# EAGLE design TT7-F v1.5 (EAGLE 7.4.0)
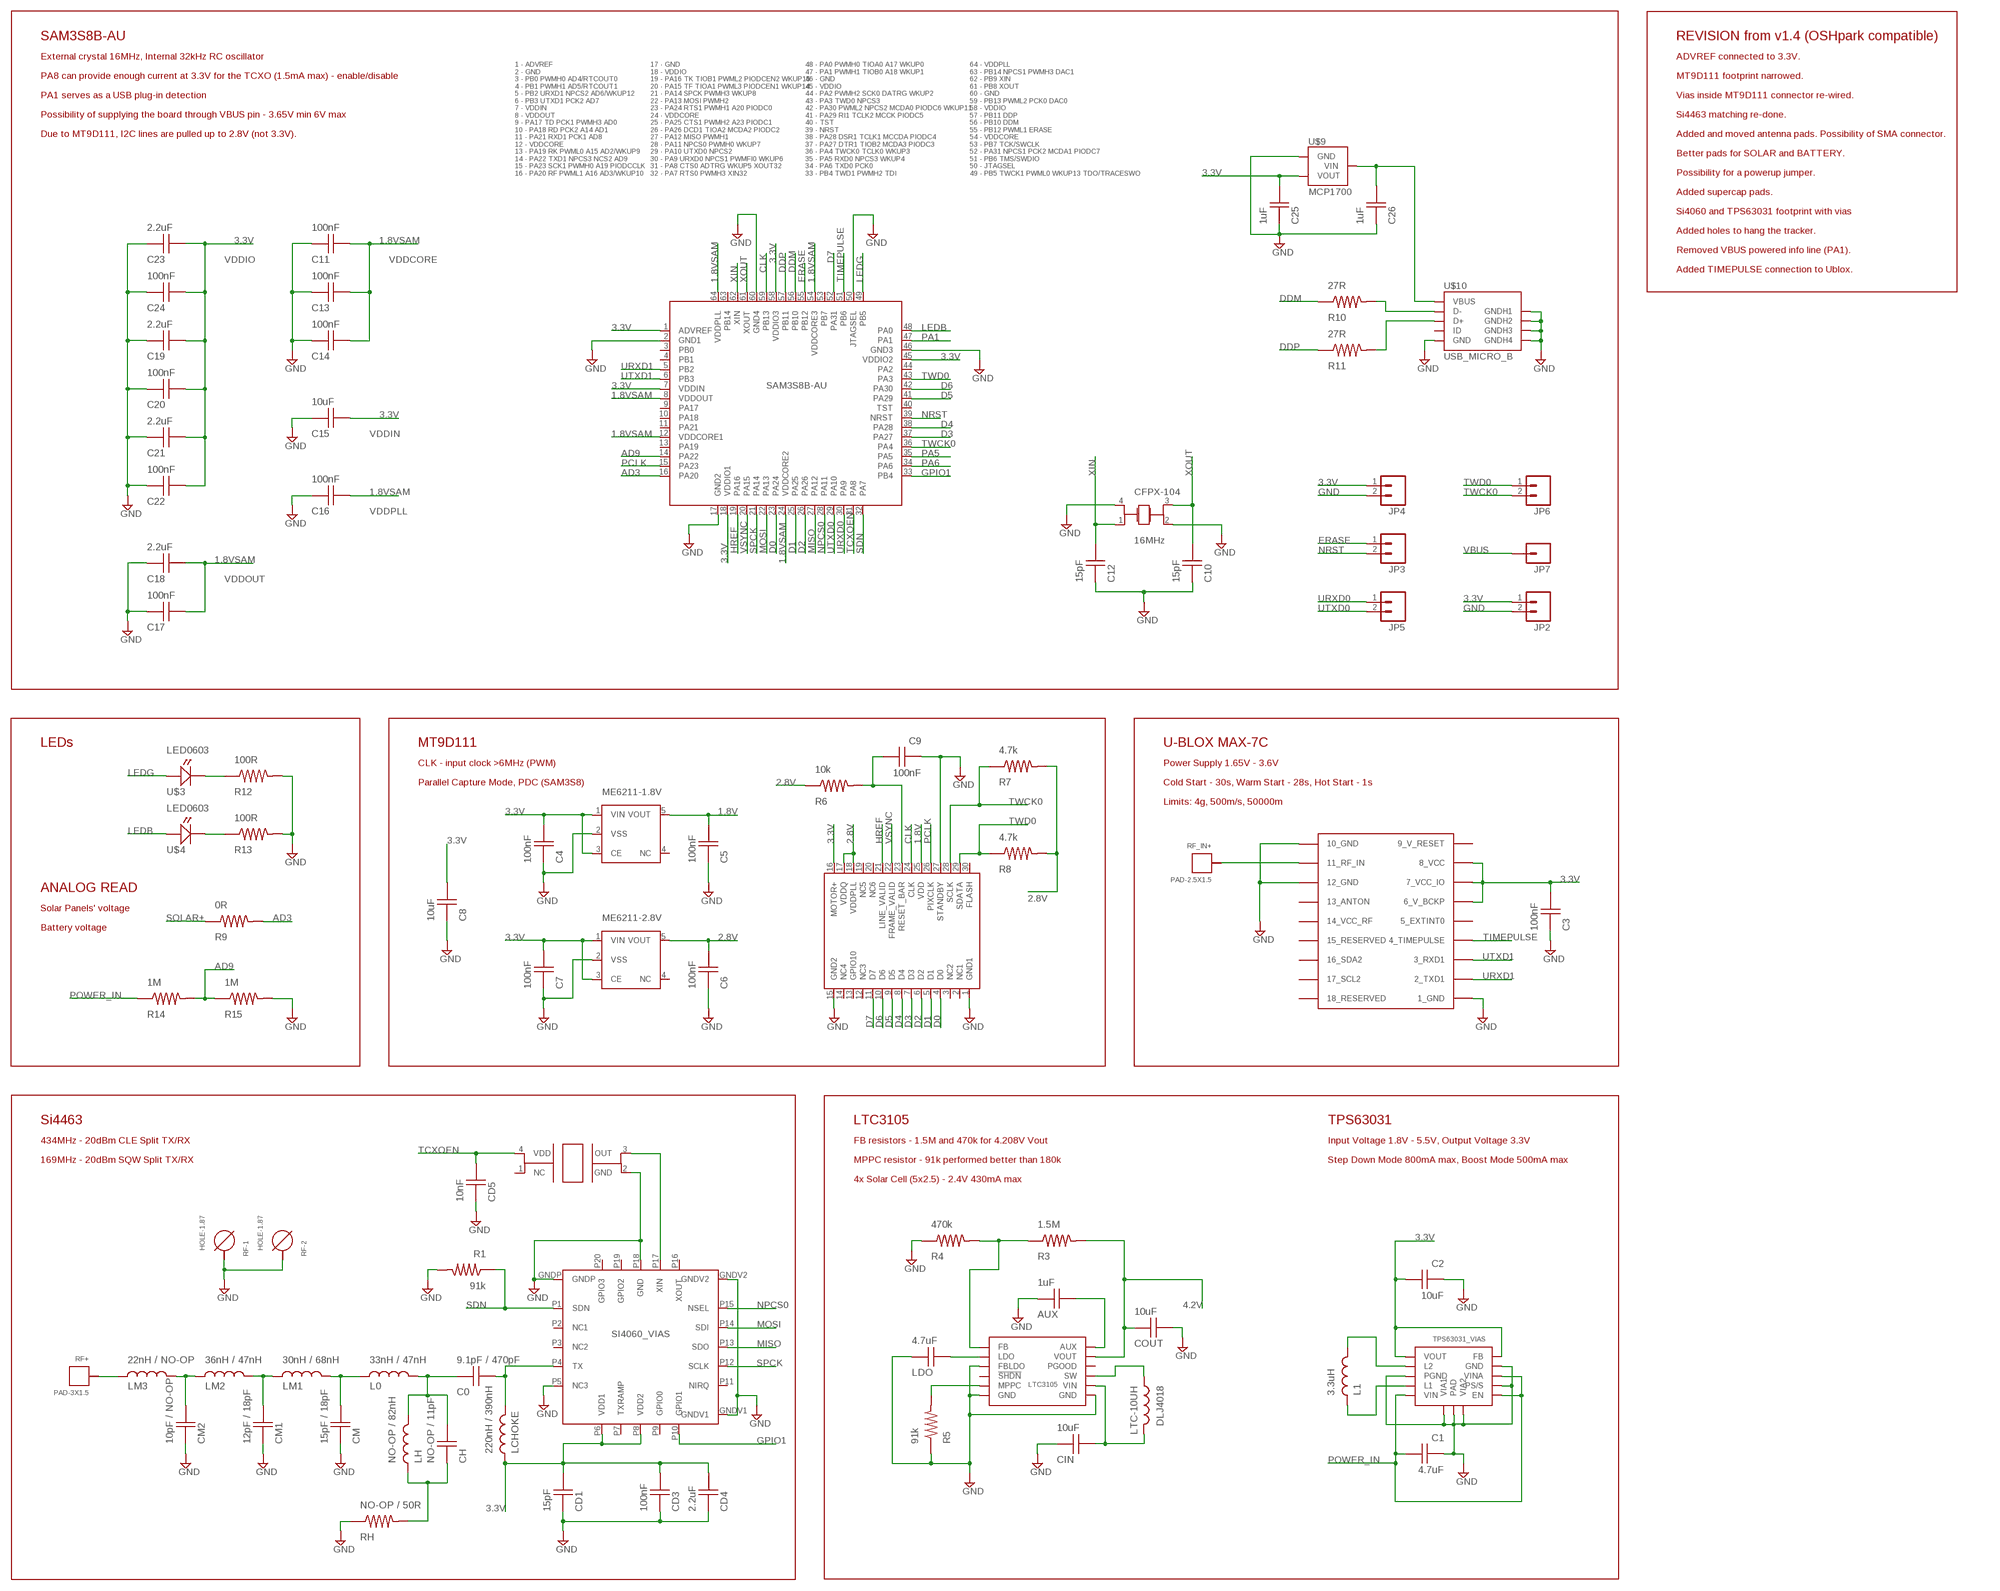
[diagram p0: schematic, sheet 1]

## Parts
AUX  1uF  CAP0603  [CAP0603]
C0  9.1pF / 470pF  CAP0402  [CAP0402]
C1  4.7uF  CAP0603  [CAP0603]
C2  10uF  CAP0805  [CAP0805]
C3  100nF  CAP0402  [CAP0402]
C4  100nF  CAP0402  [CAP0402]
C5  100nF  CAP0402  [CAP0402]
C6  100nF  CAP0402  [CAP0402]
C7  100nF  CAP0402  [CAP0402]
C8  10uF  CAP0805  [CAP0805]
C9  100nF  CAP0402  [CAP0402]
C10  15pF  CAP0402  [CAP0402]
C11  100nF  CAP0402  [CAP0402]
C12  15pF  CAP0402  [CAP0402]
C13  100nF  CAP0402  [CAP0402]
C14  100nF  CAP0402  [CAP0402]
C15  10uF  CAP0603  [CAP0603]
C16  100nF  CAP0402  [CAP0402]
C17  100nF  CAP0402  [CAP0402]
C18  2.2uF  CAP0402  [CAP0402]
C19  2.2uF  CAP0402  [CAP0402]
C20  100nF  CAP0402  [CAP0402]
C21  2.2uF  CAP0402  [CAP0402]
C22  100nF  CAP0402  [CAP0402]
C23  2.2uF  CAP0402  [CAP0402]
C24  100nF  CAP0402  [CAP0402]
C25  1uF  CAP0603  [CAP0603]
C26  1uF  CAP0603  [CAP0603]
CD1  15pF  CAP0402  [CAP0402]
CD3  100nF  CAP0402  [CAP0402]
CD4  2.2uF  CAP0402  [CAP0402]
CD5  10nF  CAP0402  [CAP0402]
CFPX-104  16MHz  CFPX-104  [CFPX-104]
CH  NO-OP / 11pF  CAP0402  [CAP0402]
CIN  10uF  CAP0603  [CAP0603]
CM  15pF / 18pF  CAP0402  [CAP0402]
CM1  12pF / 18pF  CAP0402  [CAP0402]
CM2  10pF / NO-OP  CAP0402  [CAP0402]
COUT  10uF  CAP0805  [CAP0805]
JP2  M021X02_NO_SILK  [1X02_NO_SILK]
JP3  M021X02_NO_SILK  [1X02_NO_SILK]
JP4  M021X02_NO_SILK  [1X02_NO_SILK]
JP5  M021X02_NO_SILK  [1X02_NO_SILK]
JP6  M021X02_NO_SILK  [1X02_NO_SILK]
JP7  M01PTH_NO_SILK_YES_STOP  [1X01_NO_SILK]
L0  33nH / 47nH  IND0402  [IND0402]
L1  3.3uH  DLJ3015  [DLJ3015]
LCHOKE  220nH / 390nH  IND0402  [IND0402]
LDO  4.7uF  CAP0603  [CAP0603]
LH  NO-OP / 82nH  IND0402  [IND0402]
LM1  30nH / 68nH  IND0402  [IND0402]
LM2  36nH / 47nH  IND0402  [IND0402]
LM3  22nH / NO-OP  IND0402  [IND0402]
LTC-10UH  DLJ4018  [DLJ4018]
ME6211-1.8V  ME6211_NEW  [ME6211_NEW]
ME6211-2.8V  ME6211_NEW  [ME6211_NEW]
R1  91k  RES0402  [RES0402]
R3  1.5M  RES0402  [RES0402]
R4  470k  RES0402  [RES0402]
R5  91k  RES0402  [RES0402]
R6  10k  RES0402  [RES0402]
R7  4.7k  RES0402  [RES0402]
R8  4.7k  RES0402  [RES0402]
R9  0R  RES0402  [RES0402]
R10  27R  RES0402  [RES0402]
R11  27R  RES0402  [RES0402]
R12  100R  RES0402  [RES0402]
R13  100R  RES0402  [RES0402]
R14  1M  RES0603  [RES0603]
R15  1M  RES0603  [RES0603]
RF+  PAD-3X1.5  [PAD-3X1.5]
RF-1  HOLE-1.87  [HOLE-1.87]
RF-2  HOLE-1.87  [HOLE-1.87]
RF_IN+  PAD-2.5X1.5  [PAD-2.5X1.5]
RH  NO-OP / 50R  RES0402  [RES0402]
TCXO  32MHz  I547-2P3_TCXO  [I547-2P3_TCXO]
U1  LTC3105  [LTC3105]
U3  TPS63031_VIAS  [TPS63031_VIAS]
U4  SAM3S8B-AU  [SAM3S8B-AU]
U$1  SI4060_VIAS  [SI4060_VIAS]
U$2  UBLOX_MAX-7C  [UBLOX_MAX-7C]
U$3  LED0603  [LED0603]
U$4  LED0603  [LED0603]
U$9  MCP1700  [MCP1700]
U$10  USB_MICRO_B  [USB_MICRO_B]
U$15  MT9D111-AVX145602-NEW  [MT9D111-AVX145602-NEW]

## Nets
1.8V: C5.P$2 ME6211-1.8V.5(VOUT) U$15.25(VDD)
1.8VSAM: C11.P$2 C13.P$2 C14.P$2 C16.P$2 C17.P$2 C18.P$2 U4.8(VDDOUT) U4.12(VDDCORE1) U4.24(VDDCORE2) U4.54(VDDCORE3) U4.64(VDDPLL)
2.8V: C6.P$2 ME6211-2.8V.5(VOUT) R6.P$1 R7.P$2 R8.P$2 U$15.17(VDDQ) U$15.18(VDDPLL)
3.3V: C2.P$2 C3.P$2 C4.P$2 C7.P$2 C8.P$2 C15.P$2 C19.P$2 C20.P$2 C21.P$2 C22.P$2 C23.P$2 C24.P$2 C25.P$2 CD1.P$2 CD3.P$2 CD4.P$2 JP2.1 JP4.1 LCHOKE.P$1 ME6211-1.8V.1(VIN) ME6211-1.8V.3(CE) ME6211-2.8V.1(VIN) ME6211-2.8V.3(CE) U3.1(VOUT) U3.10(FB) U4.1(ADVREF) U4.7(VDDIN) U4.18(VDDIO1) U4.45(VDDIO2) U4.58(VDDIO3) U$1.P6(VDD1) U$1.P8(VDD2) U$2.6_V_BCKP U$2.7_VCC_IO U$2.8_VCC U$9.2(VOUT) U$15.16(MOTOR+)
4.2V: COUT.P$1 R3.P$2 U1.11(VOUT)
AD3: R9.P$2 U4.16(PA20)
AD9: R14.P$2 R15.P$1 U4.14(PA22)
CLK: U4.59(PB13) U$15.24(CLK)
D0: U4.23(PA24) U$15.4(D0)
D1: U4.25(PA25) U$15.5(D1)
D2: U4.26(PA26) U$15.6(D2)
D3: U4.37(PA27) U$15.7(D3)
D4: U4.38(PA28) U$15.8(D4)
D5: U4.41(PA29) U$15.9(D5)
D6: U4.42(PA30) U$15.10(D6)
D7: U4.52(PA31) U$15.11(D7)
DDM: R10.P$1 U4.56(PB10)
DDP: R11.P$1 U4.57(PB11)
ERASE: JP3.1 U4.55(PB12)
GND: AUX.P$1 C1.P$1 C2.P$1 C3.P$1 C4.P$1 C5.P$1 C6.P$1 C7.P$1 C8.P$1 C9.P$1 C10.P$1 C11.P$1 C12.P$1 C13.P$1 C14.P$1 C15.P$1 C16.P$1 C17.P$1 C18.P$1 C19.P$1 C20.P$1 C21.P$1 C22.P$1 C23.P$1 C24.P$1 C25.P$1 C26.P$1 CD1.P$1 CD3.P$1 CD4.P$1 CD5.P$1 CFPX-104.2(GND1) CFPX-104.4(GND2) CIN.P$1 CM1.P$1 CM2.P$1 CM.P$1 COUT.P$2 JP2.2 JP4.2 LDO.P$1 ME6211-1.8V.2(VSS) ME6211-2.8V.2(VSS) R1.P$2 R4.P$1 R5.P$1 R12.P$2 R13.P$2 R15.P$2 RF-1.P$1 RF-2.P$1 RH.P$1 TCXO.2(GND) U1.3(FBLDO) U1.6(GND) U1.7(GND) U3.3(PGND) U3.7(PS/S) U3.9(GND) U3.11(PAD) U3.VIA1 U3.VIA2 U4.2(GND1) U4.17(GND2) U4.46(GND3) U4.50(JTAGSEL) U4.60(GND4) U$1.GNDP U$1.GNDV1 U$1.GNDV2 U$1.P5(NC3) U$1.P18(GND) U$2.1_GND U$2.10_GND U$2.12_GND U$9.1(GND) U$10.GND U$10.P$6(GNDH1) U$10.P$7(GNDH2) U$10.P$8(GNDH3) U$10.P$9(GNDH4) U$15.1(GND1) U$15.15(GND2) U$15.27(STANDBY)
GPIO1: U4.33(PB4) U$1.P10(GPIO1)
HREF: U4.19(PA16) U$15.21(LINE_VALID)
LEDB: U4.48(PA0) U$4.ANODE
LEDG: U4.49(PB5) U$3.ANODE
MISO: U4.27(PA12) U$1.P13(SDO)
MOSI: U4.22(PA13) U$1.P14(SDI)
N$1: CH.P$1 LH.P$1 RH.P$2
N$2: C0.P$2 LCHOKE.P$2 U$1.P4(TX)
N$3: R12.P$1 U$3.CATHODE
N$5: C0.P$1 CH.P$2 L0.P$2 LH.P$2
N$6: CM.P$2 L0.P$1 LM1.P$2
N$7: CM1.P$2 LM1.P$1 LM2.P$2
N$8: CM2.P$2 LM2.P$1 LM3.P$2
N$9: TCXO.3(OUT) U$1.P17(XIN)
N$10: L1.P$1 U3.4(L1)
N$11: LTC-10UH.P$1 U1.9(SW)
N$12: LM3.P$1 RF+.P$1
N$13: LDO.P$2 U1.2(LDO)
N$14: R5.P$2 U1.5(MPPC)
N$15: AUX.P$2 U1.12(AUX)
N$16: L1.P$2 U3.2(L2)
N$17: R3.P$1 R4.P$2 U1.1(FB)
N$18: RF_IN+.P$1 U$2.11_RF_IN
N$19: R11.P$2 U$10.D+
N$20: R10.P$2 U$10.D-
N$21: C9.P$2 R6.P$2 U$15.23(RESET_BAR)
N$25: R13.P$1 U$4.CATHODE
NPCS0: U4.28(PA11) U$1.P15(NSEL)
NRST: JP3.2 U4.39(NRST)
PA1: U4.47(PA1)
PA5: U4.35(PA5)
PA6: U4.34(PA6)
PCLK: U4.15(PA23) U$15.26(PIXCLK)
POWER_IN: C1.P$2 R14.P$1 U3.5(VIN) U3.6(EN) U3.8(VINA)
SDN: R1.P$1 U4.32(PA7) U$1.P1(SDN)
SOLAR+: CIN.P$2 LTC-10UH.P$2 R9.P$1 U1.8(VIN)
SPCK: U4.21(PA14) U$1.P12(SCLK)
TCXOEN: CD5.P$2 TCXO.4(VDD) U4.31(PA8)
TIMEPULSE: U4.51(PB6) U$2.4_TIMEPULSE
TWCK0: JP6.2 R7.P$1 U4.36(PA4) U$15.28(SCLK)
TWD0: JP6.1 R8.P$1 U4.43(PA3) U$15.29(SDATA)
URXD0: JP5.1 U4.30(PA9)
URXD1: U4.5(PB2) U$2.2_TXD1
UTXD0: JP5.2 U4.29(PA10)
UTXD1: U4.6(PB3) U$2.3_RXD1
VBUS: C26.P$2 JP7.1 U$9.3(VIN) U$10.VBUS
VSYNC: U4.20(PA15) U$15.22(FRAME_VALID)
XIN: C12.P$2 CFPX-104.1(XTAL1) U4.62(XIN)
XOUT: C10.P$2 CFPX-104.3(XTAL2) U4.61(XOUT)
Unconnected: ME6211-1.8V.4(NC) ME6211-2.8V.4(NC) TCXO.1(NC) U1.4(!SHDN) U1.10(PGOOD) U4.3(PB0) U4.4(PB1) U4.9(PA17) U4.10(PA18) U4.11(PA21) U4.13(PA19) U4.40(TST) U4.44(PA2) U4.53(PB7) U4.63(PB14) U$1.P2(NC1) U$1.P3(NC2) U$1.P7(TXRAMP) U$1.P9(GPIO0) U$1.P11(NIRQ) U$1.P16(XOUT) U$1.P19(GPIO2) U$1.P20(GPIO3) U$2.5_EXTINT0 U$2.13_ANTON U$2.14_VCC_RF U$2.15_RESERVED U$2.16_SDA2 U$2.17_SCL2 U$2.18_RESERVED U$10.ID U$15.2(NC1) U$15.3(NC2) U$15.12(NC3) U$15.13(GPIO10) U$15.14(NC4) U$15.19(NC5) U$15.20(NC6) U$15.30(FLASH)

## Notes on the sheet
- SAM3S8B-AU | REVISION from v1.4 (OSHpark compatible)
- External crystal 16MHz, Internal 32kHz RC oscillator | ADVREF connected to 3.3V.
- PA8 can provide enough current at 3.3V for the TCXO (1.5mA max) - enable/disable | MT9D111 footprint narrowed.
- PA1 serves as a USB plug-in detection | Vias inside MT9D111 connector re-wired.
- Possibility of supplying the board through VBUS pin - 3.65V min 6V max | Si4463 matching re-done.
- Due to MT9D111, I2C lines are pulled up to 2.8V (not 3.3V). | Added and moved antenna pads. Possibility of SMA connector.
- Better pads for SOLAR and BATTERY.
- Possibility for a powerup jumper.
- Added supercap pads.
- Si4060 and TPS63031 footprint with vias
- Added holes to hang the tracker.
- Removed VBUS powered info line (PA1).
- VDDIO | VDDCORE
- Added TIMEPULSE connection to Ublox.
- VDDIN
- VDDPLL
- VDDOUT
- LEDs | MT9D111 | U-BLOX MAX-7C
- CLK - input clock >6MHz (PWM) | Power Supply 1.65V - 3.6V
- Parallel Capture Mode, PDC (SAM3S8) | Cold Start - 30s, Warm Start - 28s, Hot Start - 1s
- Limits: 4g, 500m/s, 50000m
- ANALOG READ
- Solar Panels' voltage
- Battery voltage
- Si4463 | LTC3105 | TPS63031
- 434MHz - 20dBm CLE Split TX/RX | FB resistors - 1.5M and 470k for 4.208V Vout | Input Voltage 1.8V - 5.5V, Output Voltage 3.3V
- 169MHz - 20dBm SQW Split TX/RX | MPPC resistor - 91k performed better than 180k | Step Down Mode 800mA max, Boost Mode 500mA max
- 4x Solar Cell (5x2.5) - 2.4V 430mA max

## Power pins joined to a net without a drawn wire
9_V_RESET: U$2.9_V_RESET

## Library data of the parts
AUX C1 C15 C25 C26 CIN LDO = TT7:CAP0603: CAPACITOR 0603 - 1.55 x 0.85 x 0.45mm
C0 C3-C7 C9-C14 C16-C24 CD1 CD3-CD5 CH CM CM1 CM2 = TT7:CAP0402: CAPACITOR 0402 - 1 x 0.5 x 0.35mm
C2 C8 COUT = TT7:CAP0805: CAPACITOR 0805 - 2.0 x 1.2 x 0.45mm
CFPX-104 = TT7:CFPX-104: CFPX-104 Crystal Oscillator
JP2-JP6 = SparkFun-Connectors:M02: Standard 2-pin 0.1" header. Use with - straight break away headers ( PRT-00116) - right angle break away headers (PRT-00553) - swiss pins (PRT-00743) - machine pins (PRT-00117) - female headers (PRT-00115) Molex polarized connector foot print use with: PRT-08233 with associated crimp pins and housings. 2.54_SCREWTERM for use with PRT-10571. 3.5mm Screw Terminal footprints for PRT-08084 5mm Screw Terminal footprints for use with PRT-08432
JP7 = SparkFun-Connectors:M01: Header 1 Standard 1-pin 0.1" header. Use with straight break away headers (SKU : PRT-00116), right angle break away headers (PRT-00553), swiss pins (PRT-00743), machine pins (PRT-00117), and female headers (PRT-00115). SMTSO-256-ET is a "flush mount" nut for a 4-40 screw. The older package used to be too tight, and did not allow it to sit properly thru the drill hit. The latest (0.165DIA) fits nice and snug.
L0 LCHOKE LH LM1-LM3 = TT7:IND0402: INDUCTOR 0402 - 1 x 0.5 x 0.35mm
L1 = TT7:DLJ3015: FERROCORE DLJ3015-2.2
LTC-10UH = TT7:DLJ4018: FERROCORE DLJ4018-10uH
ME6211-1.8V ME6211-2.8V = TT7:ME6211_NEW: ME6211-1.8 and ME6211-2.8 in SOT23-5 package without silkscreen.
R1 R3-R13 RH = TT7:RES0402: RESISTOR 0402 - 1 x 0.5 x 0.35mm
R14 R15 = TT7:RES0603: RESISTOR 0603 - 1.55 x 0.85 x 0.45mm
RF+ = TT7:PAD-3X1.5: Pad - 3 x 1.5 mm
RF-1 RF-2 = TT7:HOLE-1.87: Hole - 1.016/1.87mm
RF_IN+ = TT7:PAD-2.5X1.5: Pad - 2.5 x 1.5 mm
TCXO = TT7:I547-2P3_TCXO: I547-2P3-32.0000M TCXO
U1 = TT7:LTC3105: LTC3105 MSOP-12
U3 = TT7:TPS63031_VIAS: TPS63031
U4 = TT7:SAM3S8B-AU: SAM3S8B-AU
U$1 = TT7:SI4060_VIAS: SI4060 with GND vias.
U$2 = TT7:UBLOX_MAX-7C: UBLOX MAX
U$3 U$4 = TT7:LED0603: LED 0603
U$9 = TT7:MCP1700: MCP1700 - SOT-23 package
U$10 = TT7:USB_MICRO_B: USB Micro-B connector
U$15 = TT7:MT9D111-AVX145602-NEW: MT9D111-AVX145602 connector with pads closer to each other

## Board
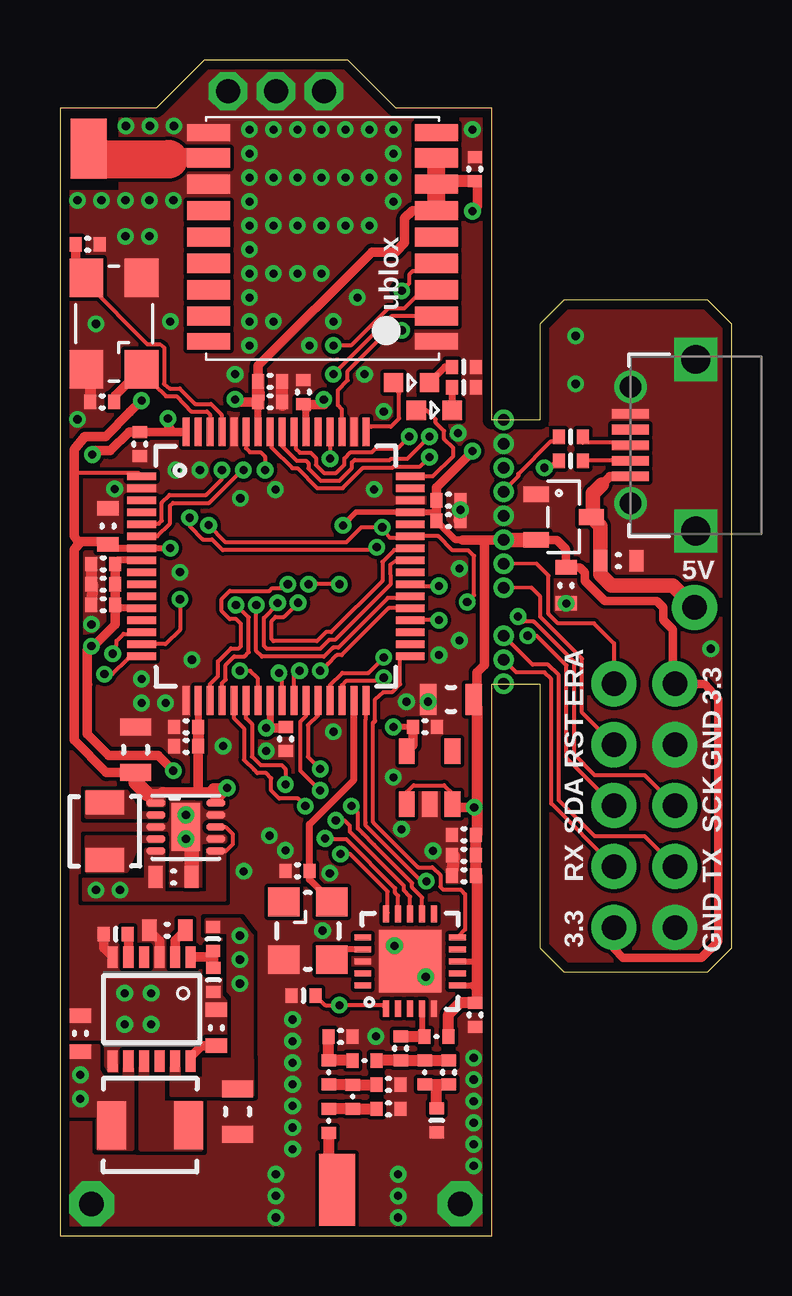
[diagram p1: board, top side]
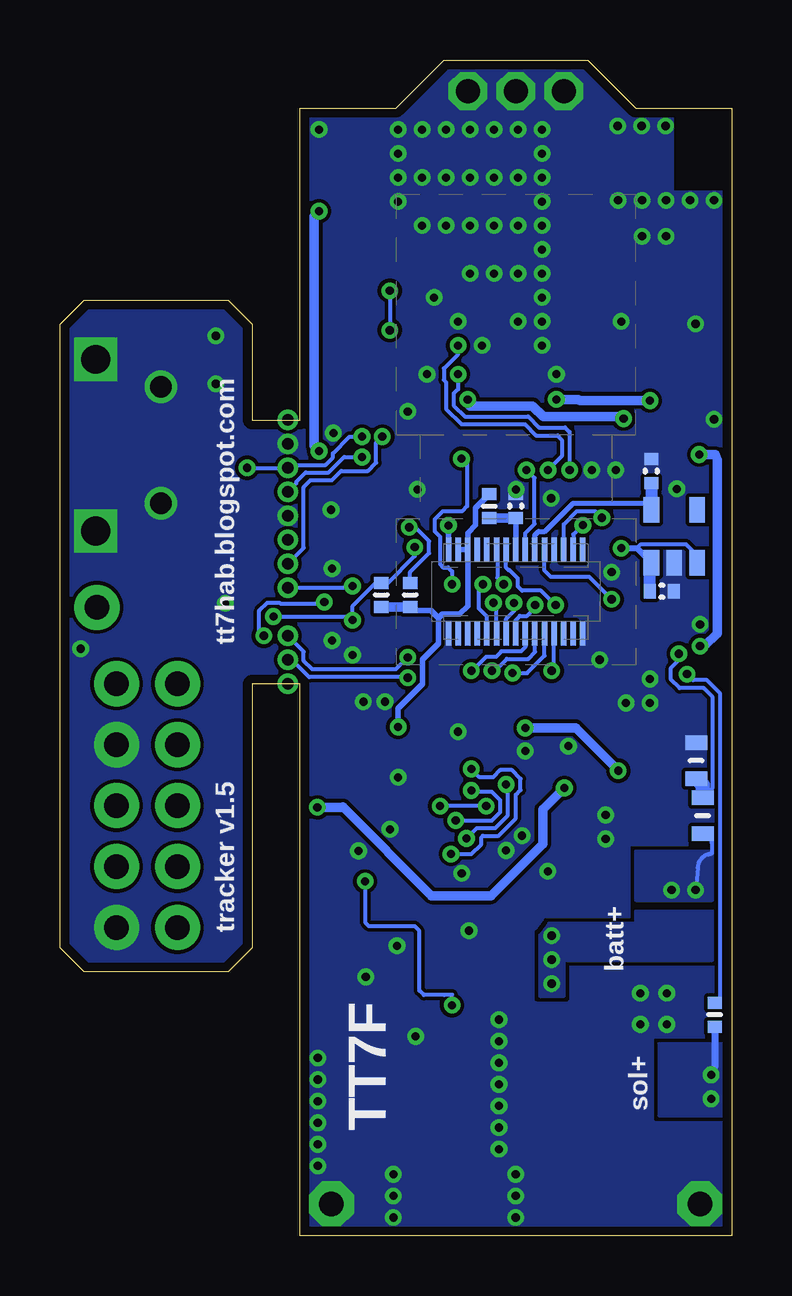
[diagram p2: board, bottom side, seen from below]

Size 28 x 49 mm. Coordinates in mm from the lower left corner, seen from the top.
Outline: 18,0 18,23 20,23 20,12 21,11 27,11 28,12 28,38 27,39 21,39 20,38 20,34 18,34 18,47 14,47 12,49 6,49 4,47 0,47 0,0 18,0
Copper layers (1*16): Top 0.0356mm / dielectric 1.5011mm / Bottom 0.0356mm
Design rules "LaenPCBOrder *": minimum track width 6mil, minimum drill 13mil, track to track 6mil, track to pad 6mil, pad to pad 6mil, via to via 6mil, smd to smd 0mil, copper to edge 15mil, drill to drill 6mil, minimum pad ring 7mil, minimum via ring 7mil, stop-mask expansion 3mil, vias tented up to drill 14mil, thermal gap 10mil

### Footprints (pad centres in the part's own frame; a part is rotated, then mirrored left to right if it is on the bottom)
CAP0603 = smd 0.6 x 0.9: P$1 -0.75,0; P$2 0.75,0
CAP0402 = smd 0.5 x 0.6: P$1 -0.5,0; P$2 0.5,0
CAP0805 = smd 0.7 x 1.3: P$1 -0.95,0; P$2 0.95,0
CFPX-104 = smd 1.6 x 1.4: 1 -1.9,-1.15; 2 1.9,-1.15; 3 1.9,1.15; 4 -1.9,1.15
1X02_NO_SILK = drill 1.016 pad 1.88: 1 0,0; 2 2.54,0
1X01_NO_SILK = drill 1.016 pad 1.88: 1 0,0
IND0402 = smd 0.5 x 0.6: P$1 -0.5,0; P$2 0.5,0
DLJ3015 = smd 1 x 1.6: P$1 -1.2,0; P$2 1.2,0
DLJ4018 = smd 1.2 x 2: P$1 -1.6,0; P$2 1.6,0
ME6211_NEW = smd 0.65 x 1.06: 1 -0.95,-1.1; 2 0,-1.1; 3 0.95,-1.1; 4 0.95,1.1; 5 -0.95,1.1
RES0402 = smd 0.5 x 0.6: P$1 -0.5,0; P$2 0.5,0
RES0603 = smd 0.6 x 0.9: P$1 -0.75,0; P$2 0.75,0
PAD-3X1.5 = smd 3 x 1.5: P$1 0,0
HOLE-1.87 = drill 1.016 pad 1.87 octagon: P$1 0,0
PAD-2.5X1.5 = smd 2.5 x 1.5: P$1 0,0
I547-2P3_TCXO = smd 1.2 x 1.3: 1 -1.2,-1; 2 1.2,-1; 3 1.2,1; 4 -1.2,1
LTC3105 = smd 0.42 x 0.9: 1 -1.625,-2.165; 2 -0.975,-2.165; 3 -0.325,-2.165; 4 0.325,-2.165; 5 0.975,-2.165; 6 1.625,-2.165; 7 1.625,2.165; 8 0.975,2.165; 9 0.325,2.165; 10 -0.325,2.165; 11 -0.975,2.165; 12 -1.625,2.165
TPS63031_VIAS = smd 0.8 x 0.28: 1 -1.25,1; 2 -1.25,0.5; 3 -1.25,0; 4 -1.25,-0.5; 5 -1.25,-1; 6 1.25,-1; 7 1.25,-0.5; 8 1.25,0; 9 1.25,0.5; 10 1.25,1 | smd 1.2 x 2: 11 0,0 | drill 0.34: VIA1 0,0.5; VIA2 0,-0.5
SAM3S8B-AU = smd 1.2 x 0.3: 1 -5.6,3.75; 2 -5.6,3.25; 3 -5.6,2.75; 4 -5.6,2.25; 5 -5.6,1.75; 6 -5.6,1.25; 7 -5.6,0.75; 8 -5.6,0.25; 9 -5.6,-0.25; 10 -5.6,-0.75; 11 -5.6,-1.25; 12 -5.6,-1.75; 13 -5.6,-2.25; 14 -5.6,-2.75; 15 -5.6,-3.25; 16 -5.6,-3.75; 33 5.6,-3.75; 34 5.6,-3.25; 35 5.6,-2.75; 36 5.6,-2.25; 37 5.6,-1.75; 38 5.6,-1.25; 39 5.6,-0.75; 40 5.6,-0.25; 41 5.6,0.25; 42 5.6,0.75; 43 5.6,1.25; 44 5.6,1.75; 45 5.6,2.25; 46 5.6,2.75; 47 5.6,3.25; 48 5.6,3.75 | smd 0.3 x 1.2: 17 -3.75,-5.6; 18 -3.25,-5.6; 19 -2.75,-5.6; 20 -2.25,-5.6; 21 -1.75,-5.6; 22 -1.25,-5.6; 23 -0.75,-5.6; 24 -0.25,-5.6; 25 0.25,-5.6; 26 0.75,-5.6; 27 1.25,-5.6; 28 1.75,-5.6; 29 2.25,-5.6; 30 2.75,-5.6; 31 3.25,-5.6; 32 3.75,-5.6; 49 3.75,5.6; 50 3.25,5.6; 51 2.75,5.6; 52 2.25,5.6; 53 1.75,5.6; 54 1.25,5.6; 55 0.75,5.6; 56 0.25,5.6; 57 -0.25,5.6; 58 -0.75,5.6; 59 -1.25,5.6; 60 -1.75,5.6; 61 -2.25,5.6; 62 -2.75,5.6; 63 -3.25,5.6; 64 -3.75,5.6
SI4060_VIAS = smd 2.6 x 2.6: GNDP 0,0 | drill 0.34: GNDV1 -0.65,-0.65; GNDV2 0.65,0.65 | smd 0.7 x 0.25: P1 -1.975,1; P2 -1.975,0.5; P3 -1.975,0; P4 -1.975,-0.5; P5 -1.975,-1; P11 1.975,-1; P12 1.975,-0.5; P13 1.975,0; P14 1.975,0.5; P15 1.975,1 | smd 0.25 x 0.7: P6 -1,-1.975; P7 -0.5,-1.975; P8 0,-1.975; P9 0.5,-1.975; P10 1,-1.975; P16 1,1.975; P17 0.5,1.975; P18 0,1.975; P19 -0.5,1.975; P20 -1,1.975
UBLOX_MAX-7C = smd 1.8 x 0.7: 1_GND 4.95,-4.4; 9_V_RESET 4.95,4.3; 10_GND -4.55,4.3; 18_RESERVED -4.55,-4.4 | smd 1.8 x 0.8: 2_TXD1 4.95,-3.35; 3_RXD1 4.95,-2.25; 4_TIMEPULSE 4.95,-1.15; 5_EXTINT0 4.95,-0.05; 6_V_BCKP 4.95,1.05; 7_VCC_IO 4.95,2.15; 8_VCC 4.95,3.25; 11_RF_IN -4.55,3.25; 12_GND -4.55,2.15; 13_ANTON -4.55,1.05; 14_VCC_RF -4.55,-0.05; 15_RESERVED -4.55,-1.15; 16_SDA2 -4.55,-2.25; 17_SCL2 -4.55,-3.35
LED0603 = smd 0.8 x 0.8: ANODE -0.75,0; CATHODE 0.75,0
MCP1700 = smd 0.65 x 1.05: 1 -0.95,-1.15; 2 0.95,-1.15; 3 0,1.15
USB_MICRO_B = smd 0.4 x 1.55: D+ 0,2.73; D- -0.65,2.73; GND 1.3,2.73; ID 0.65,2.73; VBUS -1.3,2.73 | drill 1.2 pad 1.8 square: P$6 -3.575,0; P$7 3.575,0 | drill 0.9: P$8 -2.425,2.73; P$9 2.425,2.73
MT9D111-AVX145602-NEW = smd 0.23 x 1: 1 2.8,-1.75; 2 2.4,-1.75; 3 2,-1.75; 4 1.6,-1.75; 5 1.2,-1.75; 6 0.8,-1.75; 7 0.4,-1.75; 8 0,-1.75; 9 -0.4,-1.75; 10 -0.8,-1.75; 11 -1.2,-1.75; 12 -1.6,-1.75; 13 -2,-1.75; 14 -2.4,-1.75; 15 -2.8,-1.75; 16 -2.8,1.75; 17 -2.4,1.75; 18 -2,1.75; 19 -1.6,1.75; 20 -1.2,1.75; 21 -0.8,1.75; 22 -0.4,1.75; 23 0,1.75; 24 0.4,1.75; 25 0.8,1.75; 26 1.2,1.75; 27 1.6,1.75; 28 2,1.75; 29 2.4,1.75; 30 2.8,1.75

### Placement (x,y rotation side)
AUX  6.51,8.66 270 top
C0  14.2,7.8 90 top
C1  4.74,14.95 180 top
C2  3.15,20.25 270 top
C3  17.3,44.45 270 top
C4  2.91,26.86 180 bottom
C5  3.35,31.86 270 bottom
C6  15.22,21.2 180 top
C7  16.85,16.7 0 top
C8  16.3,22.35 0 top
C9  9,30.4 270 bottom
C10  1.15,41.32 180 top
C11  9.41,20.69 90 top
C12  1.76,34.75 0 top
C13  10.15,35.15 270 top
C14  3.33,32.99 90 top
C15  2,29.57 270 top
C16  1.8,27.15 0 top
C17  1.8,26.3 0 top
C18  1.8,27.99 0 top
C19  5.26,21.2 0 top
C20  5.26,20.39 0 top
C21  16.2,29.8 180 top
C22  8.77,35.6 180 top
C23  8.76,34.75 180 top
C24  16.2,30.65 180 top
C25  21.1,27.1 90 top
C26  23.28,28.13 180 top
CD1  17.31,9.2 90 top
CD3  16.85,15 0 top
CD4  16.85,15.85 0 top
CD5  9.9,15.2 0 top
CFPX-104  2.26,38.01 90 top
CH  16.2,6.8 90 top
CIN  0.85,8.42 270 top
CM  11.7,8.3 180 top
CM1  13.7,6.3 180 top
CM2  13.7,5.28 180 top
COUT  7.4,5.17 270 top
JP2  23.1,12.84 0 top
JP3  23.1,23 270 top
JP4  25.64,23 270 top
JP5  23.1,15.38 0 top
JP6  23.1,17.92 0 top
JP7  26.46,26.18 0 top
L0  12.7,7.3 0 top
L1  1.88,16.85 90 top
LCHOKE  15.7,8.3 180 top
LDO  4.47,12.72 0 top
LH  15.2,6.8 90 top
LM1  11.2,6.8 90 top
LM2  12.2,5.79 90 top
LM3  11.2,4.78 90 top
LTC-10UH  3.76,4.6 180 top
ME6211-1.8V  2.4,29.15 0 bottom
ME6211-2.8V  15.41,19.09 0 top
R1  10.15,10 180 top
R3  6.38,12.35 90 top
R4  6.4,10.65 90 top
R5  2.33,12.57 0 top
R6  10.1,30.4 270 bottom
R7  14.6,26.7 270 bottom
R8  13.4,26.7 270 bottom
R9  0.7,9.2 90 bottom
R10  21.3,32.3 0 top
R11  21.3,33.3 0 top
R12  16.84,36.2 0 top
R13  16.84,35.35 0 top
R14  1.2,17.5 90 bottom
R15  1.47,19.8 90 bottom
RF+  11.55,1.9 90 top
RF-1  16.68,1.32 0 top
RF-2  1.32,1.32 0 top
RF_IN+  1.2,45.3 90 top
RH  15.7,4.8 90 top
TCXO  10.33,12.7 270 top
U1  3.83,9.44 180 top
U3  5.25,17.03 0 top
U4  9.01,27.9 0 top
U$1  14.6,11.43 90 top
U$2  10.75,41.67 0 top
U$3  14.65,35.55 0 top
U$4  15.6,34.4 0 top
U$9  21,29.95 270 top
U$10  26.51,32.94 90 top
U$15  9,26.84 0 bottom

### Tracks (layer width: path | path; a pad name or v marks a point on that pad's centre or on a via)
1.8V
  Bottom 0.16: 3.62,30.53 ME6211-1.8V.5
  Bottom 0.2: U$15.25 8.2,29.19 8.05,29.35 7.78,29.35 7.62,29.5 6.6,30.53 3.62,30.53
  Bottom 0.4: C5.P$2
  Bottom 0.5: C5.P$2 ME6211-1.8V.5
1.8VSAM  (via drill 0.34)
  Top 0.16: C17.P$2 2.37,26.3 | C16.P$2 2.36,27.17 | 2.36,28.15 C18.P$2 | C11.P$2 arc90 9.38,21.22 | 8.76,21.22 v8.6,21.16 | 10.26,34.47 arc90 C13.P$2
  Top 0.2: 5.23,33.49 U4.64
  Top 0.3: U4.12 2.36,26.15 | U4.8 2.36,28.15 | U4.24 8.76,21.22 | U4.54 10.26,34.47
  Top 0.35: C14.P$2 4.74,33.49 | 4.74,33.49 5.23,33.49 | v4.5,34.05 4.5,33.73 4.74,33.49
  Top 0.4: C14.P$2 2.88,33.49 2.1,32.71 1.41,32.71 v1.35,32.55 | 10.15,34.58 C13.P$2 | 9.38,21.22 9.32,21.16 v8.6,21.16 | v4.73,19.38 4.09,20.02 2.03,20.02 1.14,20.91 1.14,22.96 | 1.14,22.96 1.15,22.97 | C18.P$2 C16.P$2 C17.P$2 | 1.14,22.96 1.14,24.4 v1.31,24.57 1.4,24.57 2.3,25.46 C17.P$2 | 2.36,26.15 2.3,26.21 C17.P$2 | 10.26,34.47 10.41,34.63 11,34.63 v11,34.85
  Bottom 0.4: v1.35,32.55 0.69,32.54 0.59,32.34 0.59,25.1 1.13,24.57 v1.31,24.57 | v8.6,21.16 6.5,21.16 6.5,21.15 v4.73,19.38 | v4.5,34.05 4.58,34.13 7.84,34.13 8.29,34.58 10.92,34.58 v11,34.85
2.8V  (via drill 0.34)
  Top 0.25: C6.P$2 14.05,21.2 v13.9,21.2
  Top 0.4: C6.P$2 14.72,20.44 ME6211-2.8V.5
  Bottom 0.2: U$15.17
  Bottom 0.22: U$15.17 U$15.18 | U$15.18 11,29.29 10.68,29.61 10.68,30.32 R6.P$1 | v13.9,21.2 13.9,21.96 12.88,22.98 12.88,24.02 12.22,24.68 12.22,25.74 | U$15.18 11,26.23 11.34,25.9 12.06,25.9 12.22,25.74 | 12.22,25.74 12.54,26.06 13.26,26.06 arc90 R8.P$2
  Bottom 0.4: R7.P$2 R8.P$2
3.3V  (via drill 0.34, 0.49)
  Top 0.16: 5.75,21.24 arc-90 C19.P$2 | 2.15,28.65 C15.P$2 | 1.94,28.71 1.84,28.84 | U4.58 | C23.P$2 8.27,34.63 | 15.83,43.95 U$2.7_VCC_IO | C21.P$2 15.65,29.8 | U3.10 6.5,18.19 | U4.1 3.27,31.79 0.69,31.79 arc-90 0.53,31.95 | ME6211-2.8V.1 14.46,18.49 14.74,18.77 16.01,18.77 16.36,18.42 ME6211-2.8V.3 16.19,18.16
  Top 0.2: 0.53,31.95 arc-90 0.59,32
  Top 0.23: v11.8,29.6 12.35,30.15 13.08,30.15 14.12,30.15
  Top 0.25: 14.12,30.15 U4.45 15.7,30.15 C21.P$2 | U$1.P6 17.15,10.43 17.39,10.19 | U$1.P8 17.36,11.43 17.39,11.4 | 2.17,28.65 arc-90 C15.P$2 | U4.7 4.65,28.65 v4.6,28.65 | 1.9,28.92 1.9,28.71 | 1.9,28.65 1.9,28.71 | 1.9,28.71 1.94,28.71
  Top 0.3: CD3.P$2 17.39,14.97 | U4.18 5.75,21.24 | U4.58 C23.P$2 | 1.9,28.65 U4.7 | 16.77,29 16.49,29 C21.P$2
  Top 0.35: 25.54,23 25.55,24.75 25.55,25.26 25.15,25.66 25.15,26.18 24.88,26.45 22.71,26.45 21.89,27.27 21.89,27.64 21.68,27.85 C25.P$2 21.1,28.61 20.71,29 U$9.2 | JP2.1 23.11,11.94 23.46,11.56 26.74,11.56 27.44,12.26 27.44,22.37 26.88,23 25.54,23
  Top 0.4: 5.74,18.49 6.22,18.49 6.39,18.66 v6.96,18.66 | 5.74,18.49 4.26,18.49 4.26,18.4 3.64,18.4 | 0.8,28.84 0.59,28.59 0.59,20.65 1.93,19.3 C2.P$2 | v3.4,34.8 2.9,34.32 1.91,33.31 1.04,33.31 0.59,32.75 0.59,32 0.59,29.16 0.8,28.84 | C22.P$2 8.27,36.27 13,41 14,41 14.37,41.38 14.37,42.4 14.7,42.73 U$2.6_V_BCKP | 15.65,29.8 | v17.2,32.7 17.06,32.53 15.7,31.17 C24.P$2 | C8.P$2 17.31,22.76 | 25.54,23 JP4.1 25.54,23 | 0.8,28.84 0.88,28.92 1.9,28.92 arc-90 C15.P$2 | 17.39,22 17.39,22.21 C8.P$2 | C20.P$2 5.76,18.49 5.74,18.49 | v7.3,34.85 7.3,34.75 C23.P$2 | v17.2,42.7 17.4,42.92 17.4,43.95 C3.P$2 | 17.7,29 17.7,23.77 17.39,23.47 17.39,22.92 17.25,22.77 C8.P$2 | v17.27,17.85 16.5,17.85 arc-90 ME6211-2.8V.3 | 15.7,31.07 C24.P$2 | C24.P$2 C21.P$2 | v18.5,29 arc-90 v18.5,29 17.7,29 | 17.7,29 16.77,29
  Top 0.45: C19.P$2 C20.P$2 | LCHOKE.P$1 16.2,9.22 16.69,9.71 CD1.P$2 17.39,9.79 17.39,10.19 17.39,11.4 17.39,14.97 | CD3.P$2 CD4.P$2 C7.P$2 17.39,16.74 17.39,17.93 | 17.39,22 17.39,17.93 | 17.39,17.93 v17.27,17.85 | 6.5,18.19 v6.96,18.66
  Top 0.5: 8.27,34.63 C22.P$2 8.27,34.8 | C3.P$2 15.83,43.95
  Top 0.6: C2.P$2 3.15,18.89 3.64,18.4 | U$9.2 v18.5,29
  Top 0.75: U$2.6_V_BCKP U$2.7_VCC_IO U$2.8_VCC
  Bottom 0.16: v7.3,34.85 7,34.85 | 4.65,28.65 v4.6,28.65 | 3.94,28.65 3.78,28.81 1.9,28.81 1.45,28.36 ME6211-1.8V.3
  Bottom 0.2: U$15.16
  Bottom 0.23: v11.8,29.6 U$15.16
  Bottom 0.25: 4.65,28.65 3.94,28.65 ME6211-1.8V.1 3.41,27.98
  Bottom 0.4: v6.96,18.66 7.87,17.76 7.87,16.33 10.03,14.16 12.51,14.16 16.19,17.86 16.25,17.85 v17.27,17.85 | v3.4,34.8 6.33,34.8 6.38,34.85 7,34.85 7.29,34.85 7.3,34.84 | v17.2,42.7 17.4,42.49 17.4,32.9 v17.2,32.7
  Bottom 0.5: C4.P$2 3.41,27.98
  pour Top (no thermals): 3.65,17.95 4.35,17.95 4.35,18.61 3.65,18.61
4.2V  (via drill 0.34)
  other vias: 7.5,10.5 7.5,11.5 7.5,12.5
  pour Top (no thermals): 4.65,7 4.95,7 4.95,6.55 6,6.55 6,7.35 8,7.35 8,5.85 4.65,5.85
  pour Top (no thermals): 8,7 8,12.5 7.5,13.15 6.1,13.15 6.1,12.65 7,12.65 7,10.2 7.2,10 7.2,7
  pour Bottom (no thermals): 0.8,11.5 0.8,13.5 4,13.5 4,13 7.61,13 8,12.5 8,10 7,10 7,11.5
AD3  (via drill 0.34)
  Top 0.16: v1.85,23.4 2.18,23.4 2.84,24.06 arc-72 U4.16
  Bottom 0.16: R9.P$2 0.67,9.73 0.47,9.94 0.47,22.59 1.03,23.15 1.6,23.15 v1.85,23.4 1.65,23.19
AD9  (via drill 0.34)
  Top 0.16: v2.2,24.25 2.2,24.45 2.36,24.62 2.36,24.78 2.65,25.07 3.33,25.07 U4.14
  Bottom 0.16: R14.P$2 0.79,18.66 0.79,22.45 1.16,22.81 2.17,22.81 2.53,23.17 2.53,23.66 2.18,24 2.18,24.29 v2.2,24.25
  Bottom 0.6: R15.P$1 1.2,18.78 R14.P$2
CLK  (via drill 0.34)
  Top 0.16: U4.59 7.75,32.82 7.92,32.65 8.36,32.65 8.55,32.46 v8.55,31.91
  Bottom 0.16: U$15.24 8.6,29.28 8.22,29.66 8.22,31.58 v8.55,31.91
D0  (via drill 0.34)
  Top 0.16: U4.23 8.25,23.22 7.93,23.54 v7.5,23.54
  Bottom 0.16: U$15.4 7.4,23.64 v7.5,23.54
D1  (via drill 0.34)
  Top 0.16: U4.25 9.26,23.32 v9.13,23.45
  Bottom 0.16: v9.13,23.45 8.52,23.44 7.8,24.17 U$15.5
D2  (via drill 0.34)
  Top 0.16: U4.26 9.76,23.3 v9.99,23.54
  Bottom 0.16: U$15.6 8.19,24.33 8.47,24.04 9.37,24.04 9.87,23.54 v9.99,23.54
D3  (via drill 0.34)
  Top 0.16: 10.88,23.54 | U4.37 13.7,26.15 11.75,24.2 11.54,24.2 11.17,23.83 10.88,23.54 | v10.85,23.54 10.88,23.54
  Bottom 0.16: U$15.7 8.6,24.54 8.78,24.35 9.59,24.35 9.82,24.12 10.23,24.12 10.81,23.54 v10.85,23.54
D4  (via drill 0.34)
  Top 0.16: U4.38 14.54,26.58 13.67,26.58 11.61,24.51 11.39,24.51 11.01,24.13 8.42,24.13 8.19,24.36 v8.19,26.29
  Bottom 0.16: U$15.8 9,25.65 8.83,25.82 8.53,25.82 8.19,26.16 v8.19,26.29
D5  (via drill 0.34)
  Top 0.16: U4.41 14.11,28.2 13.77,27.95 13.77,27.13 11.47,24.83 11.22,24.83 10.85,24.45 8.63,24.45 8.5,24.58 8.5,25.75 9.07,26.32 v9.07,26.37
  Bottom 0.16: U$15.9 9.4,25.71 9.07,26.04 v9.07,26.37
D6  (via drill 0.34)
  Top 0.16: U4.42 14.54,28.58 13.95,28.58 13.45,28.08 13.45,27.29 11.31,25.15 11.09,25.15 10.71,24.78 8.9,24.78 8.83,24.85 8.83,25.62 8.99,25.78 9.34,25.78 v9.93,26.37
  Bottom 0.16: U$15.10 9.81,25.75 9.81,26.25 v9.93,26.37
D7  (via drill 0.34)
  Top 0.16: U4.52 v11.26,32.38 | v11.65,27.15 v10.36,27.15
  Bottom 0.16: U$15.11 10.2,25.8 10.54,26.15 10.54,26.97 v10.36,27.15 | v11.26,32.38 11.03,32.15 11.03,30.4 11.24,30.19 12.04,30.19 12.38,29.85 12.38,29.36 12.15,29.13 12.15,27.98 12.03,27.85 11.82,27.85 11.65,27.68 v11.65,27.15
DDM  (via drill 0.34, 0.49)
  Top 0.16: R10.P$1 20.63,32.13 20.35,32.13 v20.2,32 | U4.56 9.24,32.92 9.87,32.3 10.25,32.3 10.36,32.2 10.36,31.98 10.87,31.47 11.65,31.47 12.18,31.99 12.18,32.22 12.29,32.33 13.76,32.33 13.8,32.38 14.49,32.38 v15.41,33.3
  Bottom 0.16: v20.2,32 v18.5,32 18.38,32.12 16.93,32.12 16.62,32.43 16.62,32.6 15.93,33.29 v15.42,33.29 v15.41,33.3
DDP  (via drill 0.34, 0.49)
  Top 0.16: R11.P$1 20.58,33.08 20.45,33.08 19.11,31.74 19.11,31.66 18.5,31.05 v18.5,31 | U4.57 8.82,33.43 8.82,32.85 9.69,31.98 9.9,31.98 10.73,31.15 11.79,31.15 12.64,32.01 13.86,32.01 13.91,32.05 15.01,32.05 v15.41,32.45
  Bottom 0.16: v18.5,31 18.14,31.36 18.14,31.42 17.75,31.8 16.8,31.8 16.15,32.45 v15.41,32.45
ERASE  (via drill 0.34, 0.49)
  Top 0.16: JP3.1 23.1,24.69 22.27,25.51 20.76,25.51 20.37,25.91 20.37,27.5 19.87,28 v18.5,28 | U4.55 9.83,33.42 9.83,32.8 10,32.63 10.45,32.63 10.67,32.41 10.67,32.12 11,31.79 11.51,31.79 11.86,32.13 11.86,32.39 12.12,32.65 13.01,32.65 13.16,32.81 14.07,32.81 v14.56,33.3
  Bottom 0.16: v18.5,28 17.84,28.66 17.84,31.19 17.55,31.48 16.66,31.48 16.27,31.87 15.16,31.87 14.81,32.22 14.81,33.05 v14.56,33.3
GND  (via drill 0.34, 0.49, 1 pad 1.6)
  Top 0.16: 1.3,35.92 CFPX-104.4 | C16.P$1 1.36,27.16 | C23.P$1 9.27,34.63 | 16.44,15.81 CD4.P$1 | 16.65,29.82 16.68,29.8
  Top 0.4: U1.3 4.16,12.29 LDO.P$1 | U1.6 1.83,11.98 R5.P$1
  Top 0.45: C12.P$1 1.3,35.92 | C18.P$1 C16.P$1 | 1.36,27.16 C17.P$1
  Top 0.5: 9.27,34.63 C22.P$1 | CD3.P$1 16.44,15.81 | C24.P$1 16.65,29.82
  Top 0.6: C1.P$1 5.49,16.26
  Bottom 0.4: 2.4,26.87 C4.P$1
  other vias: 17.25,2.9 17.25,6.5 17.25,3.8 17.25,4.7 17.25,5.6 17.25,7.4 2.7,10.1 2.7,8.8 3.8,10.1 3.8,8.8 4.4,22.2 1.31,25.47 2.28,31.12 1.5,38 0.73,34.02 5.83,31.91 7.3,35.9 4.75,46.25 3.75,46.25 2.75,46.25 2.73,43.15 3.73,43.15 4.73,43.15 1.73,43.15 7.9,46.1 8.9,46.1 9.9,46.1 10.9,46.1 11.9,46.1 12.9,46.1 13.9,46.1 17.2,46.1 7.9,42.1 7.9,43.1 7.9,44.1 7.9,45.1 8.9,42.1 9.9,42.1 10.9,42.1 11.9,42.1 12.9,42.1 8.9,44.1 9.9,44.1 10.9,44.1 11.9,44.1 12.9,44.1 13.9,44.1 13.9,45.1 13.9,43.1 15.55,16.03 8.6,20.2 12.7,35.9 10.4,37.1 16.6,33.45 13.5,34.35 13.1,31.1 11.4,38.1 4.6,38.1 11.4,21 5.5,24 5,27.65 16.7,30.25 21.5,37.5 21.5,35.5 14.45,22.25 15.8,24.2 11.25,15.1 9.4,16.05 8.73,16.67 6.8,20.4 14.24,16.93 7.66,15.18 10.95,12.71 27.13,24.46 7.52,30.73 18.5,33 18.5,30 9,47.7 9.7,9 9.7,8.1 9.7,7.2 9.7,6.3 7.9,41.1 7.9,40.1 7.9,39.1 7.9,38.1 7.9,37.1 8.9,40.1 8.9,38.1 9.9,40.1 10.9,40.1 12.4,39.1 0.73,43.15 2.73,41.65 3.73,41.65 9.7,5.4 9.7,4.5 9.7,3.6 13.17,8.3 9,0.75 9,1.65 9,2.55 14.1,0.75 14.1,1.65 14.1,2.55 21.11,26.35 11,47.7 7,47.7 15.35,22.25 13.9,19.1 3.4,22.2 3.4,23.2 8.98,31.09 16.66,27.8 16.66,24.8 4.83,31.91
  pour Top (rank 2, no thermals): 0,0 18,0 18,23 20,23 20,12 21,11 27,11 28,12 28,38 27,39 21,39 20,38 20,34 18,34 18,47 14,47 12,49 6,49 4,47 2.5,47 2.5,43.5 0,43.5
  pour Bottom (rank 2, no thermals): 0,0 18,0 18,23 20,23 20,12 21,11 27,11 28,12 28,38 27,39 21,39 20,38 20,34 18,34 18,47 14,47 12,49 6,49 4,47 2.5,47 2.5,43.5 0,43.5
  pour Bottom: 2.5,29.3 4,29.3 4,29.5 2.5,29.5
GPIO1
  Top 0.16: 14.12,24.15 U4.33 14.18,24.15 14.18,23.61 14.18,22.99 13.84,22.64 13.48,22.64 13.14,22.35 13.14,21.46 arc-90 13.06,21.39 13.06,17.22 14.93,15.35 15.53,15.35 15.86,15.03 15.86,14.53 15.98,14.41 16.71,14.41 16.89,14.22 16.89,12.75 U$1.P10
HREF  (via drill 0.34)
  Top 0.16: U4.19 6.25,22.98 6.59,23.32 6.59,23.93 7.13,24.47 7.45,24.47 7.55,24.57 7.55,25.5 7.35,25.69 7.08,25.69 6.74,26.03 6.74,26.54 7.08,26.87 8.73,26.87 8.85,26.99 9.34,26.99 v9.5,27.15
  Bottom 0.16: U$15.21 9.77,28.55 9.77,27.41 v9.5,27.15
LEDB
  Top 0.16: U4.48 15.55,31.65 16.4,32.49 16.4,32.83 16.02,33.2 16.02,33.54 15.67,33.89 15.67,34.02 15.29,34.4 U$4.ANODE
LEDG
  Top 0.16: 12.76,33.05 U4.49 arc-90 12.97,33.72 13.8,33.72 14.14,34.06 14.14,35.11 U$3.ANODE
MISO  (via drill 0.34)
  Top 0.16: U$1.P13 14.6,14.12 14.33,14.39 14.33,14.58 14.19,14.72 12.43,16.49 12.09,16.83 12.09,17.08 11.87,17.3 v11.5,17.3 | U4.27 10.26,21.65 10.02,21.41 10.02,19.38 v10.85,18.55
  Bottom 0.16: v11.5,17.3 9.99,17.3 9.64,17.65 9.64,18.14 9.99,18.49 10.79,18.49 v10.85,18.55
MOSI  (via drill 0.34)
  Top 0.16: U4.22 7.75,21.57 8,21.33 8.01,19.97 8.37,19.61 9.05,19.6 9.24,19.6 9.4,19.45 v9.4,18.8 | U$1.P14 14.1,14.16 13.98,14.28 13.98,14.48 11.93,16.52 11.08,16.52 v11.05,16.55
  Bottom 0.16: v11.05,16.55 10.62,16.98 9.85,16.98 9.32,17.51 9.32,18.72 v9.4,18.8
N$1
  Top 0.45: LH.P$1 15.7,6.3 | 15.7,6.3 CH.P$1 | RH.P$2 15.7,6.3 | 15.7,6.3
N$2
  Top 0.25: 15.03,8.47 LCHOKE.P$2 15.1,8.4 U$1.P4
  Top 0.45: C0.P$2 LCHOKE.P$2
N$3
  Top 0.3: R12.P$1 16.05,36.2 U$3.CATHODE
N$4  (via drill 0.49)
  other vias: 18.5,34
N$5
  Top 0.45: CH.P$2 LH.P$2 C0.P$1 L0.P$2
N$6
  Top 0.45: L0.P$1 LM1.P$2 CM.P$2
N$7
  Top 0.45: LM1.P$1 LM2.P$2 CM1.P$2
N$8
  Top 0.45: LM3.P$2 LM2.P$1 CM2.P$2
N$9
  Top 0.16: 11.76,11.93
  Top 0.25: 11.76,11.93 arc90 TCXO.3 | U$1.P17 11.76,11.93
N$10
  pour Top (no thermals): 4.3,16.6 1.1,16.6 1.1,15.2 2.8,15.2 3.3,16.45 4.3,16.45
N$11
  pour Top (no thermals): 5.9,3.6 5.9,5.53 4.3,5.53 4.3,6.55 3.65,6.55 3.65,7 3.35,7 3.35,3.6
N$12
  Top 0.45: LM3.P$1 11.2,3.2 11.06,3 11.06,2.45 RF+.P$1
N$13
  Top 0.4: U1.2 4.8,12.31 LDO.P$2
N$14
  Top 0.16: 2.85,12.54 R5.P$2
  Top 0.4: U1.5 2.85,12.54
N$15
  Top 0.16: U1.12 5.46,7.45 | AUX.P$2
  Top 0.4: 5.46,7.45 5.92,7.91 AUX.P$2
N$16
  pour Top (no thermals): 4.3,17.45 4.3,17.6 3.3,17.6 2.8,18.5 1.1,18.5 1.1,17.45
N$17
  Top 0.16: 6.4,11.84 R3.P$1 6.13,11.61
  Top 0.4: R4.P$2 6.4,11.84 | U1.1 6.13,11.61
N$18
  Top 0.4: 1.08,44.92 1,45 1,45.33 RF_IN+.P$1
  Top 0.8: U$2.11_RF_IN 4.6,44.93 4.53,44.86
  Top 1: 1.66,44.93 1.09,44.93 1.08,44.92
  Top 1.6: 4.53,44.86 1.61,44.85 1.66,44.93
N$19
  Top 0.16: U$10.D+ 23.67,33.05 23.17,33.05 21.8,33.05 R11.P$2
N$20
  Top 0.16: U$10.D- R10.P$2
N$21
  Bottom 0.22: U$15.23 C9.P$2
  Bottom 0.25: 9,29.98 C9.P$2
  Bottom 0.4: C9.P$2 R6.P$2
N$25
  Top 0.16: 16.34,34.26 16.34,34.27
  Top 0.25: U$4.CATHODE 16.34,34.26
  Top 0.3: R13.P$1 U$4.CATHODE
N$44  (via drill 0.49)
  other vias: 18.5,23
NPCS0  (via drill 0.34)
  Top 0.16: 10.75,21.7 10.76,21.7 | U$1.P15 13.66,13.46 13.66,14.34 12.1,15.9 v11.7,15.9 | U4.28 10.76,21.7 | v10.85,19.45 10.34,19.96 10.34,21.27 10.76,21.69 10.76,21.7
  Bottom 0.16: v11.7,15.9 10.85,15.9 10.44,16.31 10.44,16.59 10.37,16.66 9.72,16.66 8.99,17.39 8.99,18.37 8.79,18.56 8.79,19.04 9.16,19.4 9.65,19.4 9.94,19.1 10.5,19.1 v10.85,19.45
NRST  (via drill 0.34, 0.49)
  Top 0.16: JP3.2 21.76,21.8 21.76,24.05 20.02,25.78 20.02,26.63 19.65,27 v18.5,27 | U4.39 14.68,27.07 v15.8,27.07
  Bottom 0.16: v15.8,27.07 15.84,27 v18.5,27
PCLK  (via drill 0.34)
  Top 0.16: v5,26.52 5,25.25 4.4,24.65 U4.15
  Bottom 0.16: U$15.26 7.8,27.72 7.54,27.45 5.93,27.45 v5,26.52
POWER_IN  (via drill 0.34)
  Top 0.16: U3.8 6.9,17.03 7.2,16.73 7.2,16.31 6.92,16.03 U3.6
  Bottom 0.16: R14.P$1 arc90 0.83,16.38 0.83,15.91 arc-90 1.41,15.33 v1.5,14.4
  other vias: 2.5,14.4
  pour Top (no thermals): 6.17,15 6.17,16.1 6.85,16.1 6.85,15
  pour Top (no thermals): 1,14 1,14.85 3.6,14.85 3.6,16.1 4.3,16.1 4.3,14.28 6.17,14.28 6.17,15 6.85,15 6.85,14
  pour Bottom (no thermals): 0.8,14 0.8,16 4,16 4,14
SDN  (via drill 0.34)
  Top 0.16: U4.32 12.76,21.52 12.74,21.52 12.75,17.21 12.75,17.09 15.07,14.77 v15.28,14.77 | R1.P$1 11.04,9.61 11.06,9.61 11.07,9.6 v11.65,9.6 13.46,9.6 U$1.P1
  Bottom 0.16: v11.65,9.6 11.65,9.58 11.65,10.04 11.97,10.03 12.83,10.03 13.01,10.21 13.01,12.7 13.2,12.89 15.11,12.89 15.28,13.05 v15.28,14.77
SOLAR+  (via drill 0.34)
  Bottom 0.3: R9.P$1 0.7,7
  other vias: 0.85,6.7 0.85,5.7
  pour Top (no thermals): 0.4,7.9 1.6,7.9 1.6,6.9 1.8,6.55 2.7,6.55 2.7,7 3,7 3,3.6 1.6,3.6 1.6,5 0.4,5
  pour Bottom (no thermals): 0,5 3,5 3,8 0,8
SPCK  (via drill 0.34)
  Top 0.16: U4.21 7.24,22.29 7.24,21.58 7.67,21.15 7.67,19.83 8.08,19.42 8.22,19.28 8.59,19.28 8.81,19.06 8.81,18.55 9.14,18.21 9.92,18.21 v10.23,17.9 | U$1.P12 15.1,14.09 14.69,14.5 14.69,14.69 14.03,15.35 arc0 12.63,16.75 12.42,16.96 12.42,17.63 v12.15,17.9
  Bottom 0.16: v10.23,17.9 v12.15,17.9
TCXOEN
  Top 0.3: TCXO.4 10.4,14.84 CD5.P$2 10.4,17.14 12.26,19 U4.31
TIMEPULSE  (via drill 0.34)
  Top 0.16: U4.51 11.76,34.44 11.58,34.61 11.58,35.24 11.99,35.65 11.99,36.03 13.69,37.73 v14.25,37.73 | U$2.4_TIMEPULSE 15.38,40.2 14.71,40.2 14.56,40.05 14.56,39.69 v14.25,39.38
  Bottom 0.16: v14.25,39.38 v14.25,37.73
TWCK0  (via drill 0.34)
  Top 0.16: JP6.2 24.38,19.18 22.3,19.18 21.44,20.04 21.44,23.9 19.75,25.59 19.32,25.59 19.32,25.61 v19.1,25.8 | v15.8,25.65 U4.36 | v13.21,28.69 13.09,28.57 6.78,28.57 6.34,29.02 5.95,29.02 5.41,29.56 v5.41,29.92
  Bottom 0.16: U$15.28 7,29.64 6.45,30.19 5.68,30.19 v5.41,29.92 | v19.1,25.8 15.95,25.8 v15.8,25.65 | v15.8,25.65 | v15.8,25.65 15.8,26.24 14.84,27.2 R7.P$1 14.33,27.2 13.21,28.32 v13.21,28.69
TWD0  (via drill 0.34)
  Top 0.16: JP6.1 21.12,19.91 21.12,23.76 19.88,25 v19.5,25 | v16.98,26.41 17.26,26.69 17.26,28.33 17.03,28.56 16.36,28.56 15.78,29.15 U4.43 14.54,29.08 13.76,29.08 v13.44,29.52 12.56,29.52 11.94,28.89 6.92,28.89 v6.2,29.61
  Bottom 0.16: U$15.29 6.6,29.22 6.21,29.61 v6.2,29.61 | U$15.29 | v19.5,25 19.69,25.19 19.69,26.04 19.35,26.38 18.84,26.38 18.8,26.34 17.05,26.34 v16.98,26.41 | R8.P$1 13.4,27.65 12.61,28.45 12.61,28.94 13.19,29.52 v13.44,29.52
URXD0  (via drill 0.34, 0.49)
  Top 0.16: JP5.1 20.48,18 20.48,23.2 20.2,23.48 19.02,23.48 v18.5,24 | U4.30 11.76,22.93 11.96,23.13 13.38,23.13 v13.5,23.25
  Bottom 0.16: v13.5,23.25 13.53,23.28 17.61,23.28 18.33,24 v18.5,24
URXD1  (via drill 0.34)
  Top 0.16: U4.5 3.43,29.67 4.12,29.67 4.24,29.79 4.24,30.55 4.57,30.87 6.08,30.87 6.75,31.54 v6.75,31.91 | U$2.2_TXD1 13.82,38.32 v11.4,35.9
  Bottom 0.16: v11.4,35.9 11.4,35.28 11.59,35.09 11.59,34.6 11.12,34.14 8.48,34.14 8.02,33.68 6.94,33.68 6.75,33.49 v6.75,31.91
UTXD0  (via drill 0.34, 0.49)
  Top 0.16: JP5.2 24.38,16.64 22.29,16.64 20.8,18.14 20.8,23.35 20.35,23.8 19.7,23.8 v18.5,25 | U4.29 11.26,22.94 11.77,23.46 12.86,23.46 v13.5,24.1
  Bottom 0.16: v13.5,24.1 14,23.6 17.48,23.6 17.84,23.95 17.84,24.34 v18.5,25
UTXD1  (via drill 0.34)
  Top 0.16: U$2.3_RXD1 15.1,39.42 15.1,39.39 14.35,38.64 13.68,38.64 12.13,37.1 v11.4,37.1 | U4.6 4.05,29.15 4.59,29.68 4.59,30.42 4.71,30.54 6.21,30.54 7.58,31.91 v7.65,31.91
  Bottom 0.16: v11.4,37.1 11.41,36.73 11.99,36.14 11.99,35.66 11.9,35.57 11.9,34.46 11.26,33.81 8.61,33.81 8.15,33.35 7.26,33.35 7.08,33.17 7.08,32.48 v7.65,31.91
VBUS
  Top 0.4: U$10.VBUS 22.94,31.64 22.6,31.31
  Top 0.6: 22.6,31.31 22.23,30.94 22.22,30.94 22.22,30.02 arc-90 U$9.3 22.53,29.57 C26.P$2 22.52,28.12 22.52,27.56 22.99,27.09 25.55,27.09 JP7.1
VSYNC  (via drill 0.34)
  Top 0.16: U4.20 6.75,23.02 6.91,23.18 6.91,23.78 7.26,24.14 7.69,24.14 7.87,24.32 7.87,25.76 v7.33,26.28
  Bottom 0.16: v7.33,26.28 7.37,26.3 7.95,26.88 8.73,26.88 8.92,27.06 8.92,27.39 9.26,27.73 9.3,27.73 9.4,27.84 U$15.22
XIN
  Top 0.16: CFPX-104.1 3.41,35.98 4.42,34.98 4.86,34.98 5.47,34.35 6.13,34.35 6.26,34.22 U4.62 | C12.P$2 2.3,35
  Top 0.4: 2.3,35 CFPX-104.1
XOUT
  Top 0.16: U4.61 6.74,34.22 6.71,34.25 6.65,34.31 6.3,34.67 5.64,34.66 5,35.31 4.58,35.31 4.34,35.5 4.34,37.02 4.17,37.16 3.64,37.16 1.11,39.69 CFPX-104.3 0.65,40.37
  Top 0.4: C10.P$2 0.65,40.37

### Text on the board
tPlace: 5V | ERA | 3.3 | RST | GND | SDA | SCK | RX | TX | 3.3 | GND
bPlace: tt7hab.blogspot.com | tracker v1.5 | batt+ | TT7F | sol+
tDocu: 100nF | UBLOX MAX-7C | 15pF | CFPX104 16MHz | 100R | 2.2uF | 100nF | 100R | 15pF | 100nF | 100nF | 27R | USB Micro B | OSG50603C1E | 27R | OSB50603C1E | 100nF | 91k | 75k | 10uF | 2.2uF | 2.2uF | SAM3S8B | MCP1700T3302E | 100nF | 100nF | 1uF | 1uF | 10uF | 100nF | 100nF | 2.2uF | 100nF | 10uF | ME6211-2.8V | DLJ3015-2.2uH | TPS63031 | 100nF | 10nF | 2.2uF | 4.7uF | I547-2P3-32MHz | 100nF | SI4060 | 100pF | 91k | 4.7uF | 1.5M | 470k | 15pF | LTC3105 | 1uF | 91k | 10uF | 220nH | 15pF | 56nH | 10uF | 8.2pF | 15pF | 18nH | 18nH | 8.2pF | DLJ4018-10uH | 0R
bDocu: 100nF | 100nF | 10k | 1.5k | MT9D111 | 100nF | 1.5k | 0R